# EAGLE design furby_connector (EAGLE 6.3)
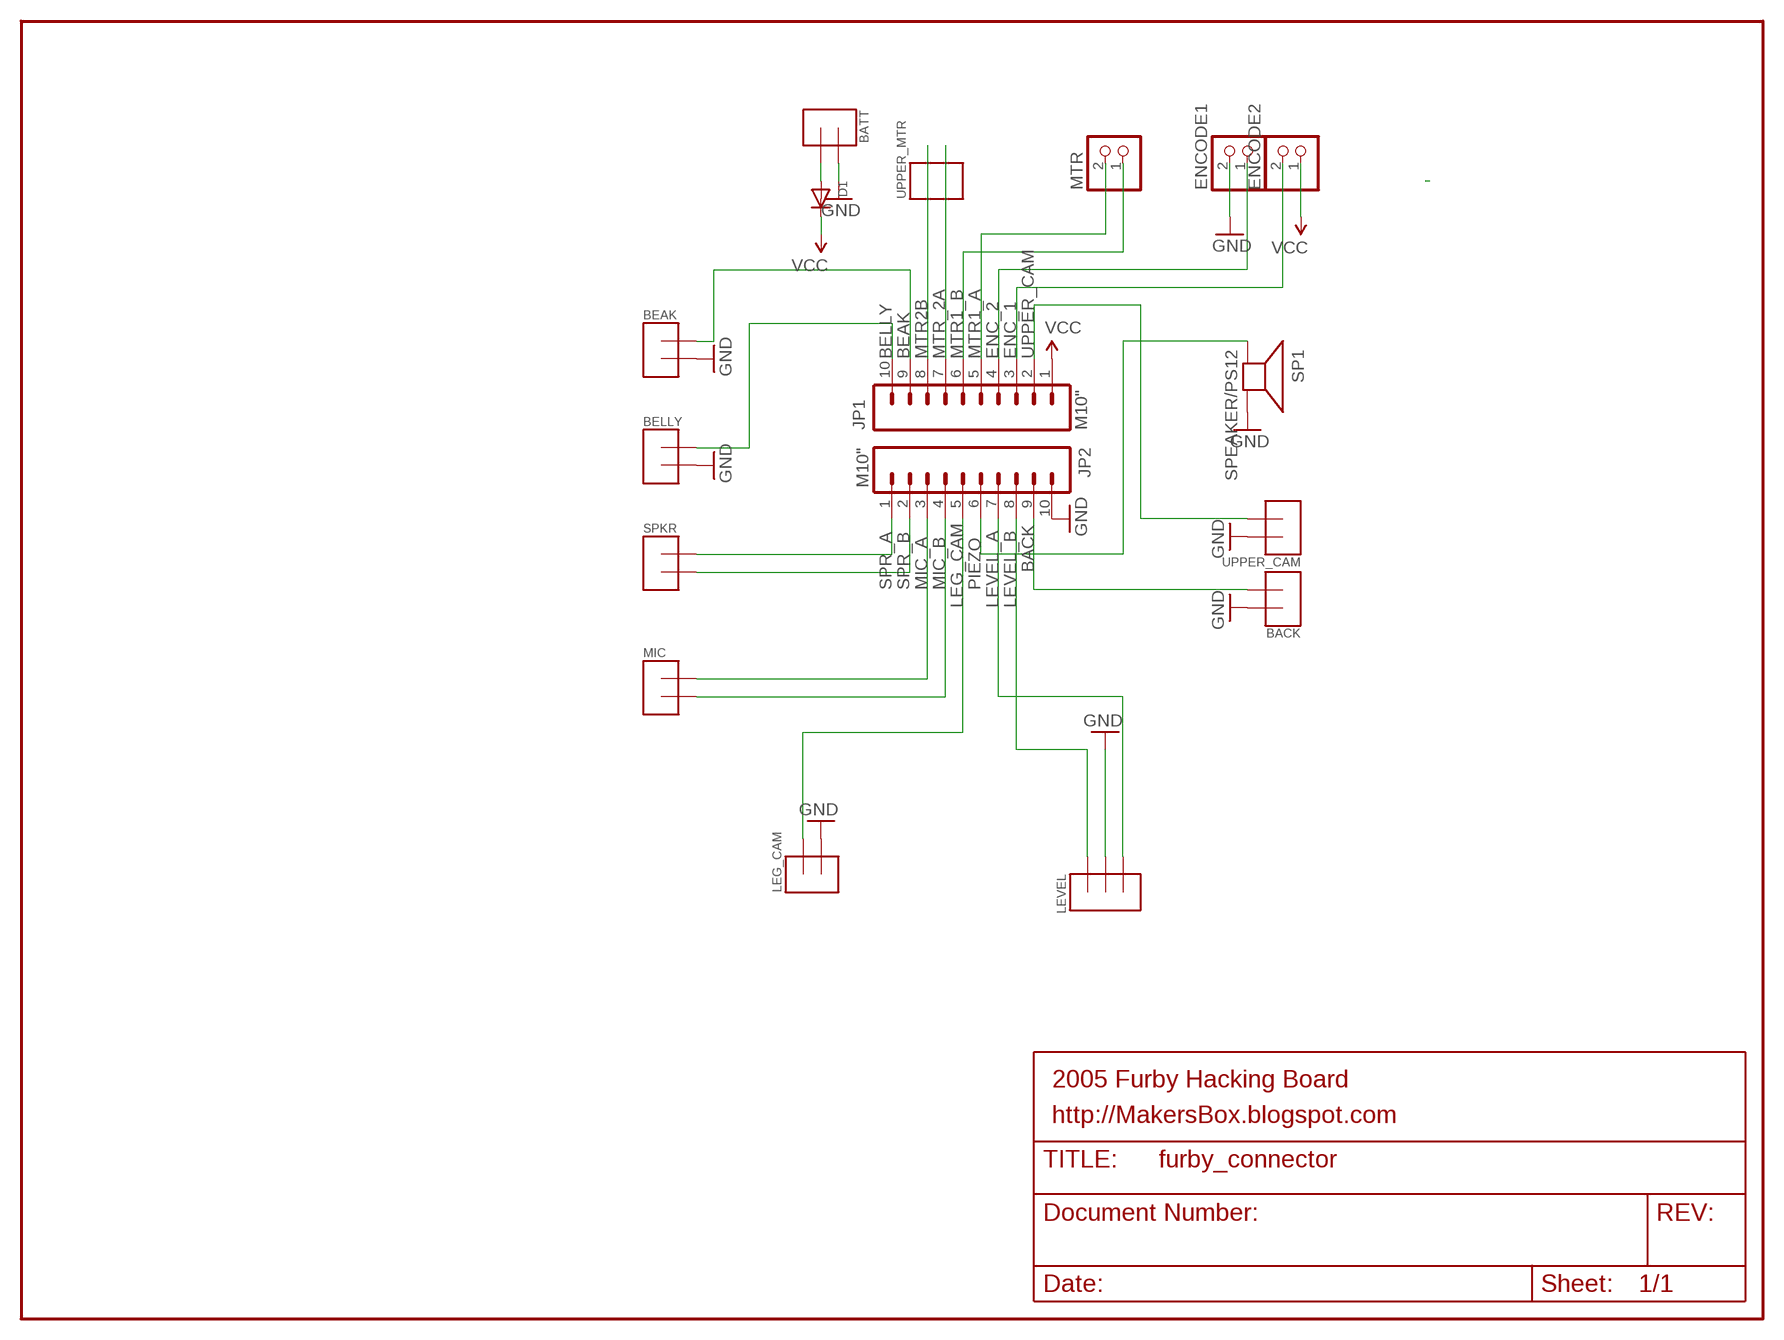
[diagram p0: schematic, sheet 1]

## Parts
BACK  TERMINAL2  [TERMINAL_2]
BATT  TERMINAL2  [TERMINAL_2]
BEAK  TERMINAL2  [TERMINAL_2]
BELLY  TERMINAL2  [TERMINAL_2]
D1  DIODEDO-1N4148  [DO-1N4148]
ENCODE1  JST_2PIN-THM  [JST-PH-2-THM]
ENCODE2  JST_2PIN-THM  [JST-PH-2-THM]
JP1  M10"  [1X10]
JP2  M10"  [1X10]
LEG_CAM  TERMINAL2  [TERMINAL_2]
LEVEL  TERMINAL  [TERMINAL_3]
MIC  TERMINAL2  [TERMINAL_2]
MTR  JST_2PIN-THM  [JST-PH-2-THM]
SP1  SPEAKER/PS12  [PS12]
SPKR  TERMINAL2  [TERMINAL_2]
UPPER_CAM  TERMINAL2  [TERMINAL_2]
UPPER_MTR  TERMINAL2  [TERMINAL_2]

## Nets
BACK: BACK.P$2 JP2.9
BEAK: BEAK.P$1 JP1.9
BELLY: BELLY.P$1 JP1.10
ENC_1: ENCODE2.2 JP1.3
ENC_2: ENCODE1.1 JP1.4
GND [power]: BACK.P$1 BATT.P$1 BEAK.P$2 BELLY.P$2 ENCODE1.2 JP2.10 LEG_CAM.P$2 LEVEL.P$2 SP1.P$2(-) UPPER_CAM.P$1
LEG_CAM: JP2.5 LEG_CAM.P$1
LEVEL_A: JP2.7 LEVEL.P$3
LEVEL_B: JP2.8 LEVEL.P$1
MIC_A: JP2.3 MIC.P$1
MIC_B: JP2.4 MIC.P$2
MTR1_A: JP1.5 MTR.2
MTR1_B: JP1.6 MTR.1
MTR2B: JP1.8 UPPER_MTR.P$1
MTR_2A: JP1.7 UPPER_MTR.P$2
N$1: BATT.P$2 D1.A
PIEZO: JP2.6 SP1.P$1(+)
SPR_A: JP2.1 SPKR.P$1
SPR_B: JP2.2 SPKR.P$2
UPPER_CAM: JP1.2 UPPER_CAM.P$2
VCC: D1.C ENCODE2.1 JP1.1

## Notes on the sheet
- 2005 Furby Hacking Board
- http://MakersBox.blogspot.com

## Library data of the parts
BACK BATT BEAK BELLY LEG_CAM MIC SPKR UPPER_CAM UPPER_MTR = _my-parts:TERMINAL2
D1 = adafruit:DIODE: Diode SMADIODE - SMA Surface Mount Package 20V 1A Schottky Diode Digikey: 641-1014-6-ND DO-1N4148 - Through Hole Small Current Diode SOD-123 20V 1 A (.5mV Vf) Schottky Diode - Digikey: MBRX120TPMSCT-ND SOD-323 10V 570mA (.38mV Vf, 3ns) Schottky Diode - Digikey: ZLLS410CT-ND SOD-523 30V 30mA Schottky Diode (RB751S-40TE61) - Digikey: RB751S-40TE61CT-ND SOT23-R/W - SOT23 Package (R = Solder Paste/Reflow Ovens, W = Hand-Soldering) BAT54Film 40V 300mA - Digikey: 497-7162-1-ND
ENCODE1 ENCODE2 MTR = adafruit_mod:JST_2PIN: JST 2-Pin Connectors of various flavors SMT-RA (S2B-PH-SM4) 4UConnector #17311 SMT (B2B-PH-SM4) THM-RA (S2B-PH) THM (B2B-PH)
JP1 JP2 = SparkFun:M10: Header 10 Standard 10-pin 0.1" header. Use with straight break away headers (SKU : PRT-00116), right angle break away headers (PRT-00553), swiss pins (PRT-00743), machine pins (PRT-00117), and female headers (PRT-00115).
LEVEL = _my-parts:TERMINAL
SP1 = adafruit:SPEAKER: SPEAKER Source: Buerklin Added PS12 (for part # PS1240 piezo) http://www.ladyada.net/library/pcb/eaglelibrary.html

## Net classes
0 default: width 0.203 mm
1 power: width 0.61 mm

## Board
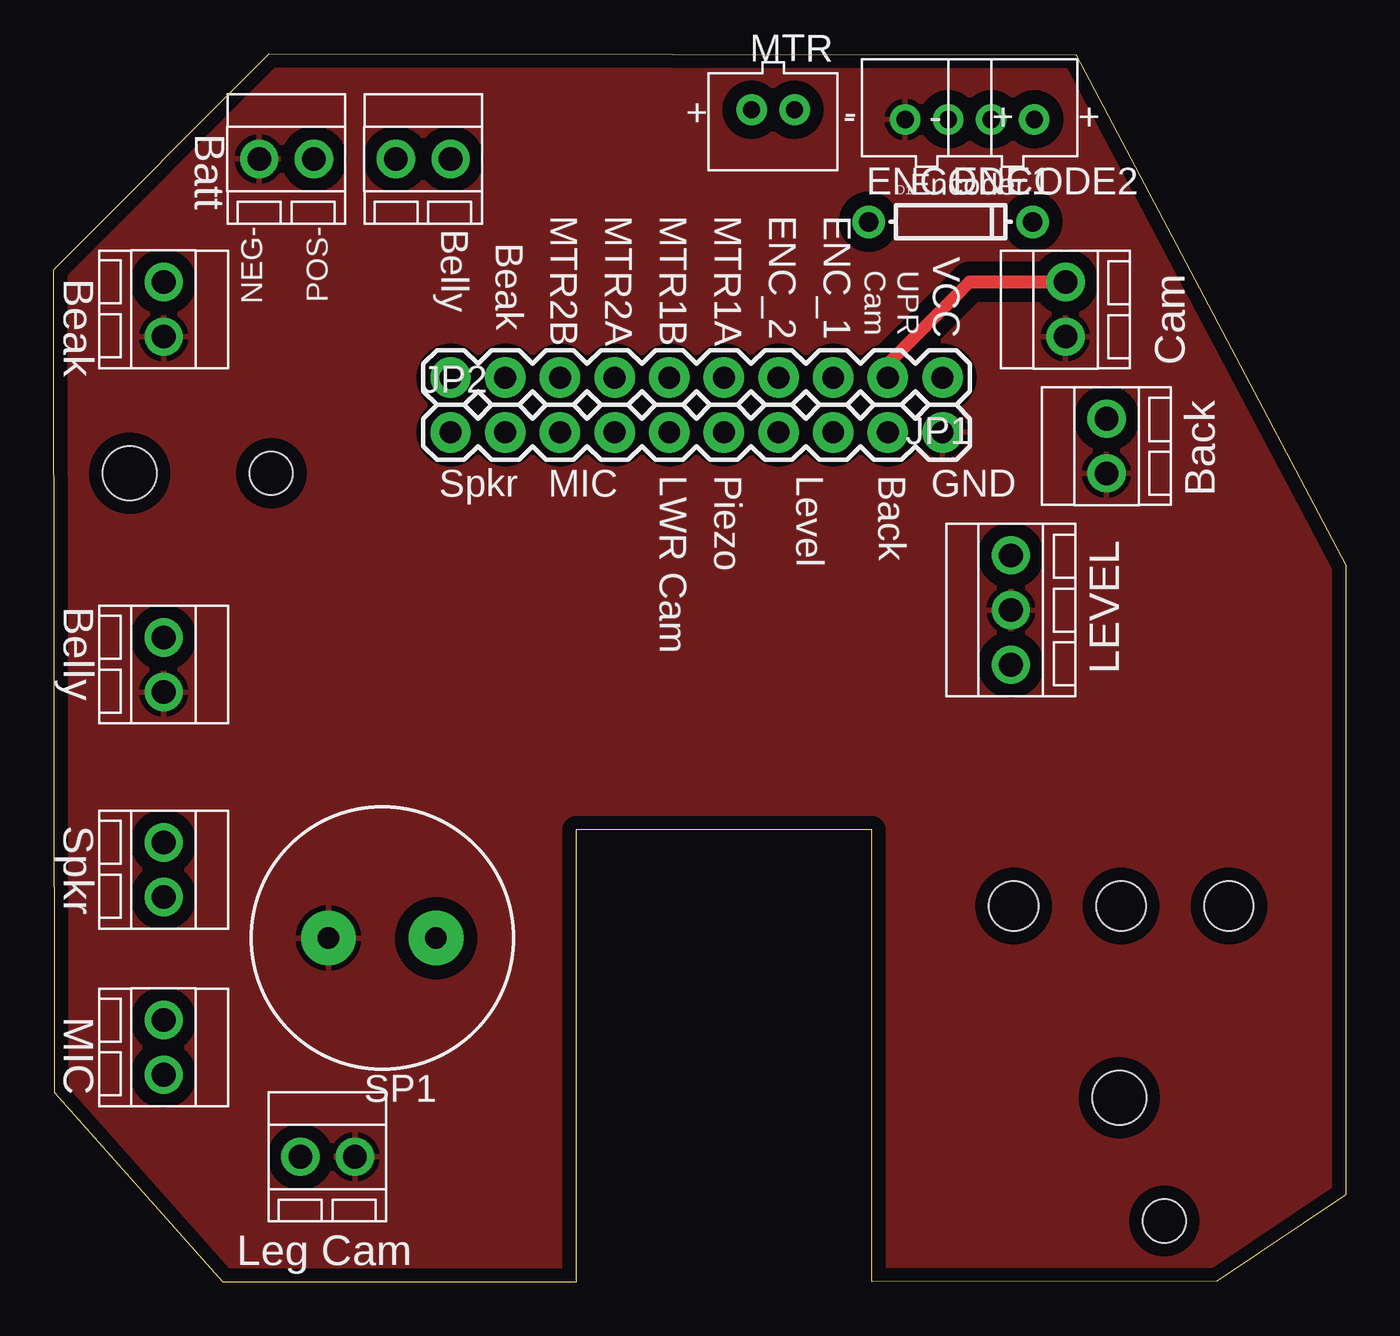
[diagram p1: board, top side]
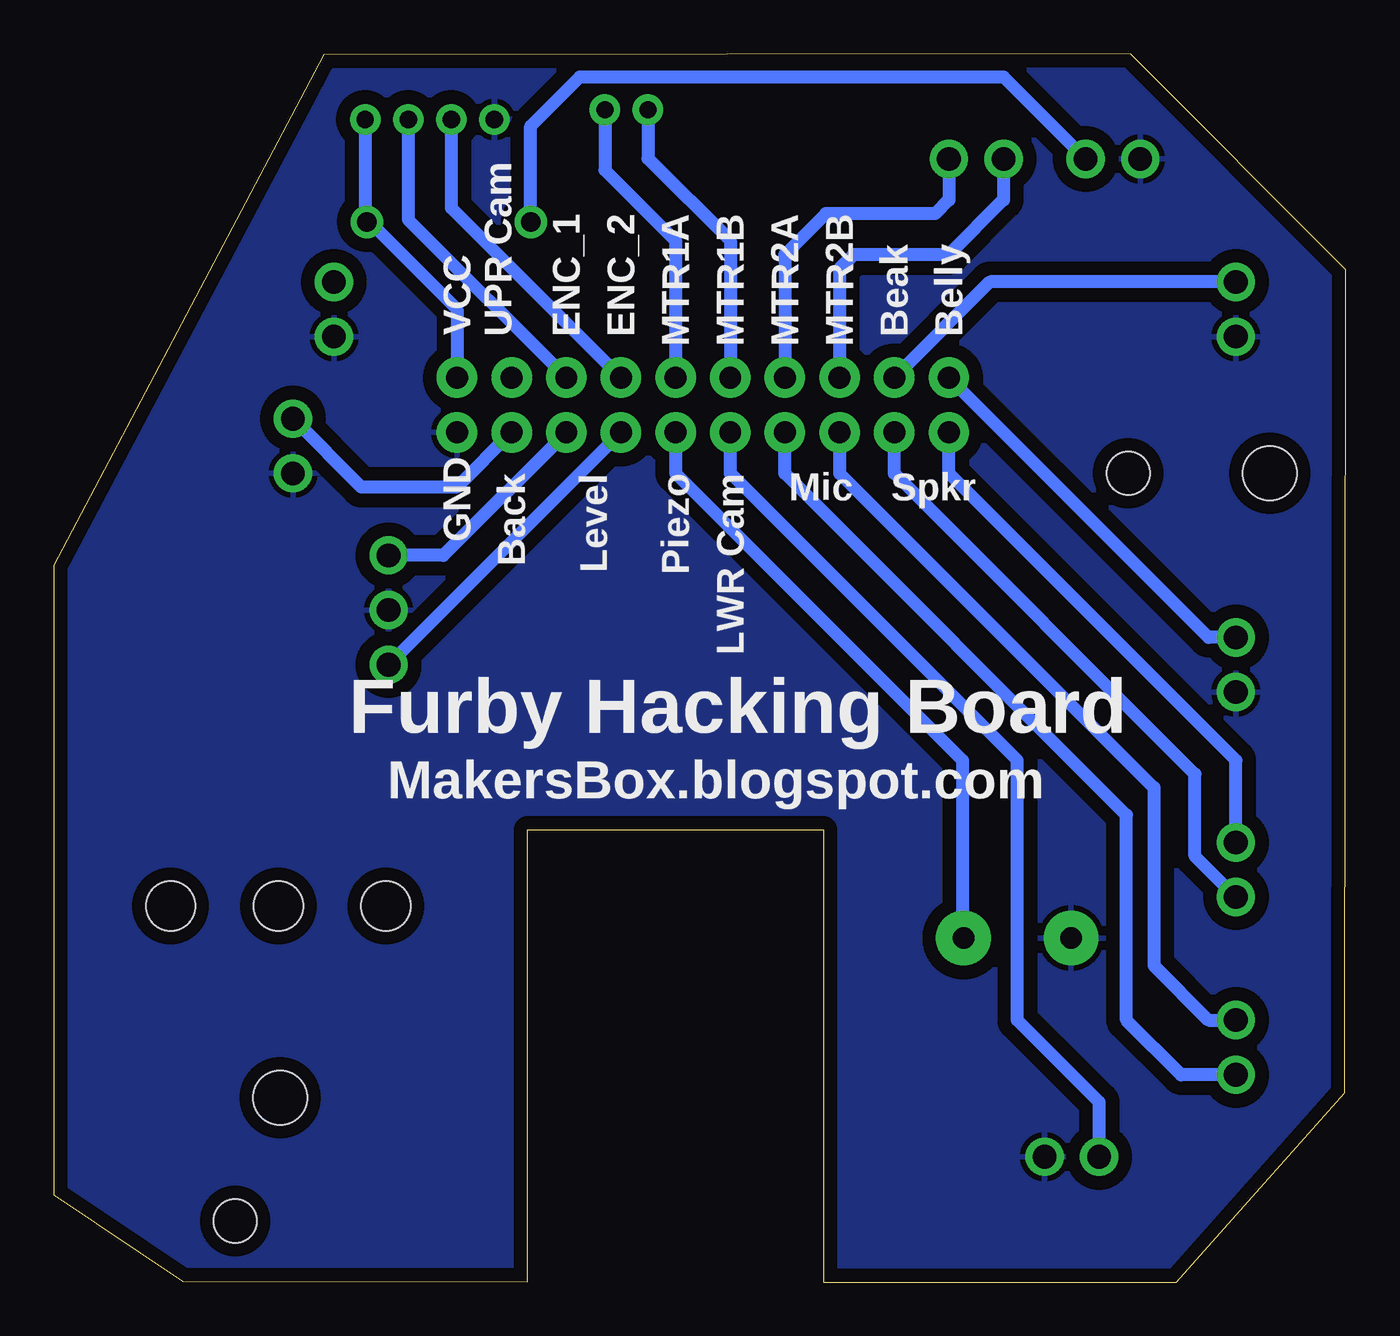
[diagram p2: board, bottom side, seen from below]

Size 60.03 x 57.06 mm. Coordinates in mm from the lower left corner, seen from the top.
Outline: 10.01,57.06 0,47.03 0.05,8.79 7.86,0 24.26,0 24.27,21.01 38.02,21.01 38.02,0.01 54.03,0.05 60.03,4.05 60.03,33.31 47.49,57.01 10,57.05
Copper layers (1*16): Top 0.035mm / dielectric 1.5mm / Bottom 0.035mm
Design rules "SparkFun": minimum track width 8mil, minimum drill 20mil, track to track 8mil, track to pad 8mil, pad to pad 8mil, via to via 8mil, smd to smd 8mil, copper to edge 10mil, drill to drill 8mil, minimum pad ring 12mil, minimum via ring 10mil, stop-mask expansion 4mil, vias tented up to drill 25mil, thermal gap 10mil
Holes 2 mm at 10.11,37.57 51.61,2.84
Holes 2.5 mm at 3.52,37.57 49.52,8.57
Holes 2.29 mm at 49.61,17.47 54.61,17.47 44.61,17.47

### Footprints (pad centres in the part's own frame; a part is rotated, then mirrored left to right if it is on the bottom)
TERMINAL_2 = drill 1.1 pad 1.778: P$1 1.27,0; P$2 -1.27,0
DO-1N4148 = drill 0.9: A -3.81,0; C 3.81,0
JST-PH-2-THM = drill 0.8 pad 1.422: 1 1,0; 2 -1,0
1X10 = drill 1.016 pad 1.88: 1 0,0; 2 2.54,0; 3 5.08,0; 4 7.62,0; 5 10.16,0; 6 12.7,0; 7 15.24,0; 8 17.78,0; 9 20.32,0; 10 22.86,0
TERMINAL_3 = drill 1.1 pad 1.778: P$1 -2.54,0; P$2 0,0; P$3 2.54,0
PS12 = drill 1 pad 2.54: P$1 -2.5,0; P$2 2.5,0

### Placement (x,y rotation side)
BACK  48.92,38.84 270 top
BATT  10.82,52.17 180 top
BEAK  5.1,45.19 90 top
BELLY  5.1,28.68 90 top
D1  41.68,49.25 0 top
ENCODE1  40.56,54.01 0 top
ENCODE2  44.56,54.01 0 top
JP1  41.3,42.02 180 top
JP2  18.44,39.48 0 top
LEG_CAM  12.72,5.82 180 top
LEVEL  44.47,31.22 270 top
MIC  5.1,10.9 90 top
MTR  33.42,54.46 180 top
SP1  15.26,15.98 180 top
SPKR  5.1,19.16 90 top
UPPER_CAM  47.01,45.19 270 top
UPPER_MTR  17.17,52.17 180 top

### Tracks (layer width: path | path; a pad name or v marks a point on that pad's centre or on a via)
BACK
  Bottom 0.61: JP2.9 41.3,36.93 45.74,36.93 BACK.P$2
BEAK
  Bottom 0.61: BEAK.P$1 16.53,46.46 JP1.9
BELLY
  Bottom 0.61: BELLY.P$1 6.37,29.95 JP1.10
ENC_1
  Bottom 0.61: ENCODE2.2 43.56,49.36 JP1.3
ENC_2
  Bottom 0.61: ENCODE1.1 41.56,49.9 JP1.4
GND
  pour Bottom (isolate 0.635): -5.06,-1.8 -5.06,60.43 62.25,60.43 62.25,-3.07 -5.06,-3.07
  pour Top (isolate 0.635): -3.79,-1.8 -3.79,59.16 60.98,59.16 60.98,-1.8
LEG_CAM
  Bottom 0.61: LEG_CAM.P$1 11.45,8.36 15.26,12.17 15.26,24.23 28.6,37.57 JP2.5
LEVEL_A
  Bottom 0.61: JP2.7 LEVEL.P$3
LEVEL_B
  Bottom 0.61: JP2.8 41.93,33.76 LEVEL.P$1
MIC_A
  Bottom 0.61: JP2.3 23.52,37.57 8.91,22.96 8.91,14.71 6.37,12.17 MIC.P$1
MIC_B
  Bottom 0.61: MIC.P$2 7.64,9.63 10.18,12.17 10.18,21.7 26.06,37.57 JP2.4
MTR1_A
  Bottom 0.61: MTR.2 34.42,51.65 31.14,48.36 JP1.5
MTR1_B
  Bottom 0.61: MTR.1 32.42,52.19 28.6,48.36 JP1.6
MTR2B
  Bottom 0.61: UPPER_MTR.P$1 15.9,50.27 18.44,47.73 22.88,47.73 23.52,47.09 JP1.8
MTR_2A
  Bottom 0.61: UPPER_MTR.P$2 18.44,50.27 19.07,49.63 24.15,49.63 26.06,47.73 JP1.7
N$1
  Bottom 0.61: D1.A 37.87,53.7 35.58,55.98 15.9,55.98 BATT.P$2
PIEZO
  Bottom 0.61: JP2.6 31.14,37.57 17.8,24.23 17.8,16.02 SP1.P$1
SPR_A
  Bottom 0.61: SPKR.P$1 5.1,24.23 18.44,37.57 JP2.1
SPR_B
  Bottom 0.61: SPKR.P$2 7.01,19.79 7.01,23.6 20.98,37.57 JP2.2
UPPER_CAM
  Top 0.61: JP1.2 38.76,42.65 42.57,46.46 UPPER_CAM.P$2
VCC
  Bottom 0.61: ENCODE2.1 45.56,49.33 D1.C 45.36,49.25 41.3,45.19 JP1.1

### Text on the board
tPlace: Batt | MTR2B | MTR2A | MTR1B | MTR1A | ENC_2 | ENC_1 | Encoder | NEG- / / POS- | Belly | Beak | VCC | Beak | UPR / Cam | Cam | LWR Cam | Piezo | Level | Back | Back | Spkr | MIC | GND | Belly | LEVEL | Spkr | MIC | Leg Cam
bPlace: MTR2B | MTR2A | MTR1B | MTR1A | ENC_2 | ENC_1 | VCC | Belly | Beak | UPR Cam | Spkr | Mic | LWR Cam | Piezo | Level | Back | GND | Furby Hacking Board | MakersBox.blogspot.com